# EAGLE design mixer (EAGLE 9.6.2)
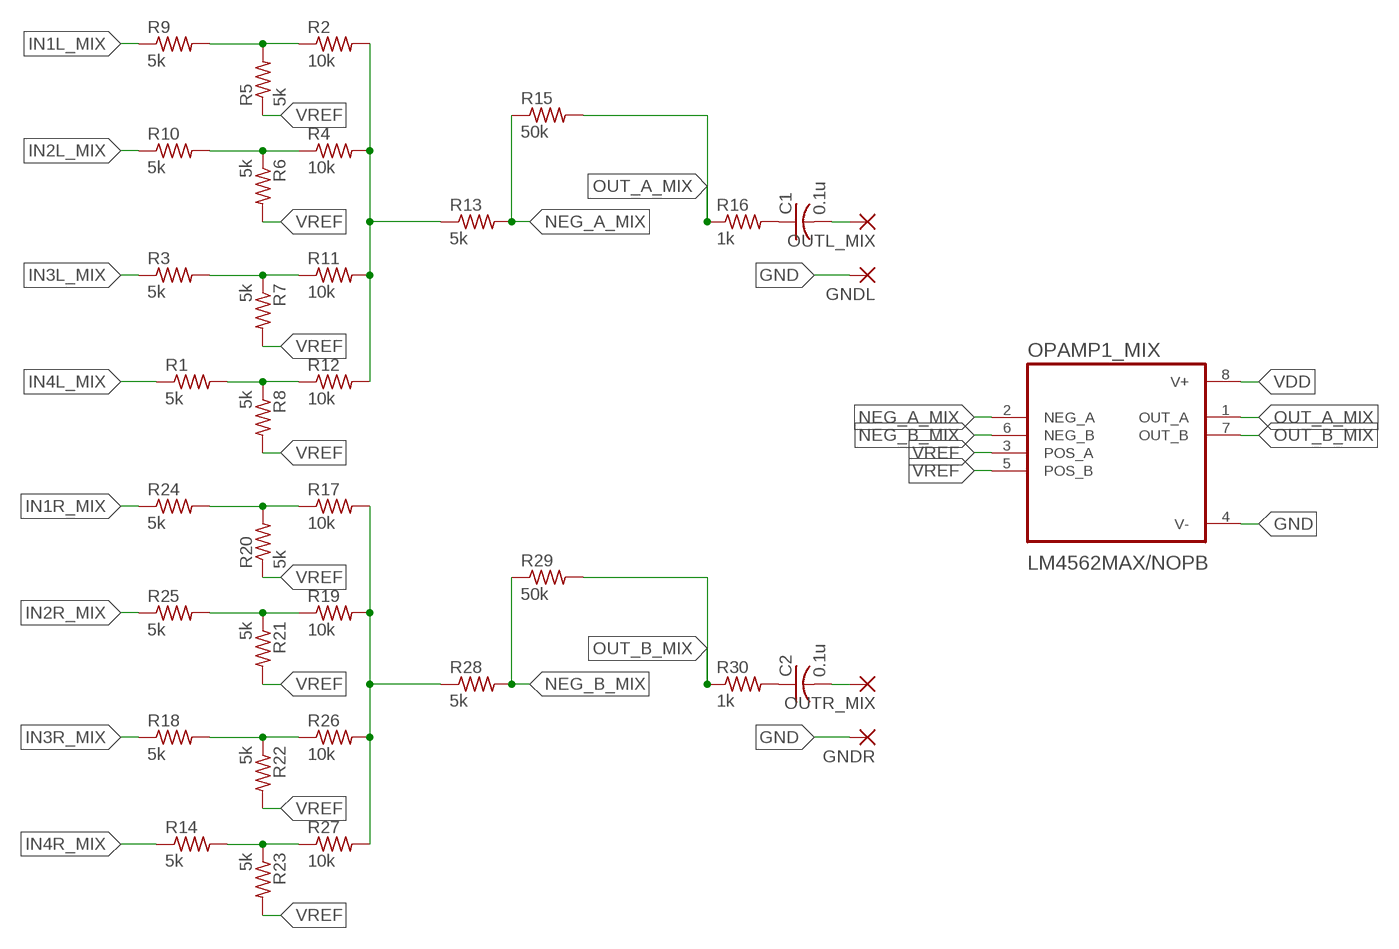
[diagram p0: schematic, sheet 1]

## Parts
C1  0.1u  C-USC0402  [C0402]
C2  0.1u  C-USC0402  [C0402]
GNDL  SMD5  [SMD2,54-5,08]
GNDR  SMD5  [SMD2,54-5,08]
OPAMP1_MIX  LM4562MAX/NOPB  [SOIC127P599X175-8N]
OUTL_MIX  SMD5  [SMD2,54-5,08]
OUTR_MIX  SMD5  [SMD2,54-5,08]
R1  5k  R-US_R0402  [R0402]
R2  10k  R-US_R0402  [R0402]
R3  5k  R-US_R0402  [R0402]
R4  10k  R-US_R0402  [R0402]
R5  5k  R-US_R0402  [R0402]
R6  5k  R-US_R0402  [R0402]
R7  5k  R-US_R0402  [R0402]
R8  5k  R-US_R0402  [R0402]
R9  5k  R-US_R0402  [R0402]
R10  5k  R-US_R0402  [R0402]
R11  10k  R-US_R0402  [R0402]
R12  10k  R-US_R0402  [R0402]
R13  5k  R-US_R0402  [R0402]
R14  5k  R-US_R0402  [R0402]
R15  50k  R-US_R0402  [R0402]
R16  1k  R-US_R0402  [R0402]
R17  10k  R-US_R0402  [R0402]
R18  5k  R-US_R0402  [R0402]
R19  10k  R-US_R0402  [R0402]
R20  5k  R-US_R0402  [R0402]
R21  5k  R-US_R0402  [R0402]
R22  5k  R-US_R0402  [R0402]
R23  5k  R-US_R0402  [R0402]
R24  5k  R-US_R0402  [R0402]
R25  5k  R-US_R0402  [R0402]
R26  10k  R-US_R0402  [R0402]
R27  10k  R-US_R0402  [R0402]
R28  5k  R-US_R0402  [R0402]
R29  50k  R-US_R0402  [R0402]
R30  1k  R-US_R0402  [R0402]

## Nets
GND: GNDL.1(P) GNDR.1(P) OPAMP1_MIX.4(V-)
IN1L_MIX: R9.1
IN1R_MIX: R24.1
IN2L_MIX: R10.1
IN2R_MIX: R25.1
IN3L_MIX: R3.1
IN3R_MIX: R18.1
IN4L_MIX: R1.1
IN4R_MIX: R14.1
N$1: C1.1 R16.2
N$2: C2.1 R30.2
N$3: R17.1 R20.2 R24.2
N$4: R17.2 R19.2 R26.2 R27.2 R28.1
N$5: R14.2 R23.1 R27.1
N$6: R18.2 R22.1 R26.1
N$7: R19.1 R21.1 R25.2
N$13: R2.1 R5.2 R9.2
N$14: R2.2 R4.2 R11.2 R12.2 R13.1
N$15: R1.2 R8.1 R12.1
N$16: R3.2 R7.1 R11.1
N$17: R4.1 R6.1 R10.2
NEG_A_MIX: OPAMP1_MIX.2(NEG_A) R13.2 R15.1
NEG_B_MIX: OPAMP1_MIX.6(NEG_B) R28.2 R29.1
OUT_A_MIX: OPAMP1_MIX.1(OUT_A) R15.2 R16.1
OUT_B_MIX: OPAMP1_MIX.7(OUT_B) R29.2 R30.1
OUTL_MIX: C1.2 OUTL_MIX.1(P)
OUTR_MIX: C2.2 OUTR_MIX.1(P)
VDD: OPAMP1_MIX.8(V+)
VREF: OPAMP1_MIX.3(POS_A) OPAMP1_MIX.5(POS_B) R5.1 R6.2 R7.2 R8.2 R20.1 R21.2 R22.2 R23.2

## Library data of the parts
C1 C2 = rcl:C-US: CAPACITOR, American symbol; SPICEPREFIX: C
GNDL GNDR OUTL_MIX OUTR_MIX = wirepad:SMD5: SMD PAD
OPAMP1_MIX = LM4562MAX_NOPB:LM4562MAX/NOPB: Check availability <https://pricing.snapeda.com/parts/LM4562MAX/NOPB/Texas%20Instruments/view-part?ref=eda>; AVAILABILITY: In Stock; CHECK_PRICES: https://www.snapeda.com/parts/LM4562MAX/NOPB/Texas+Instruments/view-part/?ref=eda; DESCRIPTION: 2-channel, 55-MHz, high-fidelity, high performance audio op amp; MF: Texas Instruments; MP: LM4562MAX/NOPB; PACKAGE: SOIC-8 Texas Instruments; PRICE: None; PURCHASE-URL: https://www.snapeda.com/api/url_track_click_mouser/?unipart_id=21165&manufacturer=Texas Instruments&part_name=LM4562MAX/NOPB&search_term=lm4562; SNAPEDA_LINK: https://www.snapeda.com/parts/LM4562MAX/NOPB/Texas+Instruments/view-part/?ref=snap
R1-R30 = rcl:R-US_: RESISTOR, American symbol; SPICEPREFIX: R

## Board
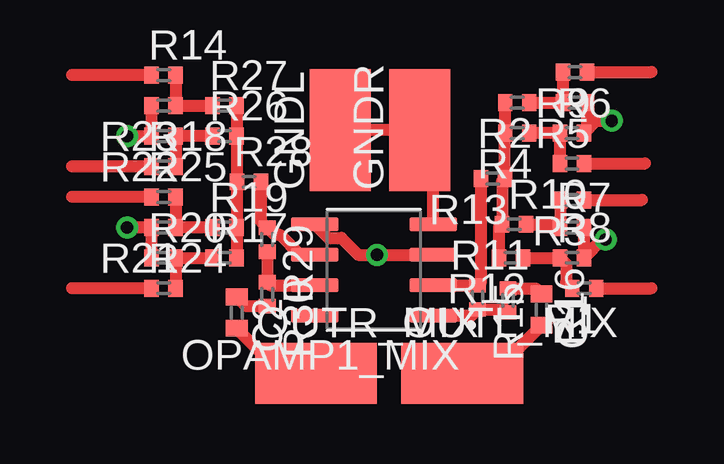
[diagram p1: board, top side]
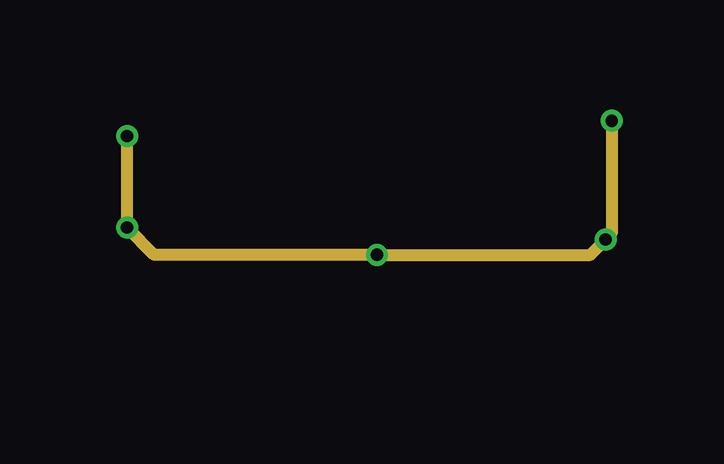
[diagram p2: board, inner layer Route15]

No outline drawn. Coordinates in mm, seen from the top.
Copper layers (1+2*15+16): Top 0.035mm / dielectric 0.2mm / Route2 0.035mm / dielectric 0.15mm / Route15 0.035mm / dielectric 0.2mm / Bottom 0.035mm
Design rules "default *": minimum track width 6mil, minimum drill 0.35mm, track to track 6mil, track to pad 6mil, pad to pad 6mil, via to via 6mil, smd to smd 6mil, copper to edge 40mil, drill to drill 6mil, minimum pad ring 10mil, minimum via ring 8mil, stop-mask expansion 4mil, vias tented up to drill 0mil, thermal gap 10mil

### Footprints (pad centres in the part's own frame; a part is rotated, then mirrored left to right if it is on the bottom)
C0402 = smd 0.7 x 0.9: 1 -0.65,0; 2 0.65,0
SMD2,54-5,08 = smd 2.54 x 5.08: 1 0,0
SOIC127P599X175-8N = smd 1.97 x 0.6: 1 -2.47,1.905; 2 -2.47,0.635; 3 -2.47,-0.635; 4 -2.47,-1.905; 5 2.47,-1.905; 6 2.47,-0.635; 7 2.47,0.635; 8 2.47,1.905
R0402 = smd 0.6 x 0.7: 1 -0.5,0; 2 0.5,0

### Placement (x,y rotation side)
C1  14.48,-9.78 270 top
C2  1.78,-9.91 270 top
GNDL  6.1,-2.29 0 top
GNDR  9.4,-2.29 0 top
OPAMP1_MIX  7.49,-8.13 180 top
OUTL_MIX  11.18,-12.45 270 top
OUTR_MIX  5.08,-12.45 270 top
R1  16.26,-8.89 180 top
R2  13.46,-1.14 180 top
R3  15.75,-5.21 180 top
R4  13.46,-2.41 180 top
R5  15.88,-1.14 180 top
R6  15.75,-2.41 0 top
R7  15.75,-6.35 0 top
R8  15.75,-7.62 0 top
R9  15.88,0.13 180 top
R10  15.75,-3.68 180 top
R11  13.34,-6.22 180 top
R12  13.21,-7.62 180 top
R13  12.45,-4.32 180 top
R14  -1.27,0 0 top
R15  11.81,-9.27 270 top
R16  13.08,-9.4 90 top
R17  1.27,-7.62 0 top
R18  -1.27,-3.81 0 top
R19  1.27,-6.35 0 top
R20  -1.27,-7.62 0 top
R21  -1.27,-6.35 180 top
R22  -1.27,-2.54 180 top
R23  -1.27,-1.27 180 top
R24  -1.27,-8.89 0 top
R25  -1.27,-5.08 0 top
R26  1.27,-2.54 0 top
R27  1.27,-1.27 0 top
R28  2.29,-4.45 0 top
R29  3.05,-6.86 270 top
R30  3.05,-9.14 270 top

### Tracks (layer width: path | path; a pad name or v marks a point on that pad's centre or on a via)
GND
  Top 0.508: OPAMP1_MIX.4 9.96,-2.85 GNDR.1 GNDL.1
IN1L_MIX
  Top 0.508: R9.1 19.05,0.13
IN1R_MIX
  Top 0.508: R24.1 -5.08,-8.89
IN2L_MIX
  Top 0.508: R10.1 18.8,-3.68
IN2R_MIX
  Top 0.508: R25.1 -5.08,-5.08
IN3L_MIX
  Top 0.508: R3.1 18.67,-5.21
IN3R_MIX
  Top 0.508: R18.1 -5.08,-3.81
IN4L_MIX
  Top 0.508: R1.1 19.05,-8.89
IN4R_MIX
  Top 0.508: R14.1 -5.08,0
N$1
  Top 0.508: R16.2 14.25,-8.9 C1.1
N$2
  Top 0.508: R30.2 2.17,-9.64 C2.1
N$3
  Top 0.508: R24.2 R20.2 R17.1
N$4
  Top 0.508: R27.2 R26.2 1.77,-4.43 R28.1 1.79,-6.33 R19.2 R17.2
N$5
  Top 0.508: R14.2 R23.1 R27.1
N$6
  Top 0.508: R18.2 R22.1 R26.1
N$7
  Top 0.508: R25.2 R21.1 R19.1
N$13
  Top 0.508: R9.2 R5.2 R2.1
N$14
  Top 0.508: R12.2 12.71,-6.35 R11.2 12.84,-4.43 R13.1 12.95,-2.43 R4.2 R2.2
N$15
  Top 0.508: R12.1 R8.1 15.5,-7.87 15.5,-8.64 R1.2
N$16
  Top 0.508: R3.2 R7.1 15.12,-6.22 R11.1
N$17
  Top 0.508: R10.2 R6.1 R4.1
NEG_A_MIX
  Top 0.508: R13.2 11.95,-8.64 R15.1 | R15.1 | OPAMP1_MIX.2 R15.1
NEG_B_MIX
  Top 0.508: R28.2 2.79,-6.1 R29.1 3.34,-6.65 3.57,-6.65 4.41,-7.49 OPAMP1_MIX.6
OUT_A_MIX
  Top 0.508: OPAMP1_MIX.1 11.55,-10.03 R15.2 12.95,-9.77 R16.1
OUT_B_MIX
  Top 0.508: R29.2 R30.1 3.17,-8.76 OPAMP1_MIX.7
OUTL_MIX
  Top 0.508: C1.2 12.46,-12.45 OUTL_MIX.1
OUTR_MIX
  Top 0.508: C2.2 3.67,-12.45 OUTR_MIX.1
VREF  (via drill 0.51)
  Top 0.508: R7.2 R8.2 17.01,-6.86 v17.14,-6.86 | R5.1 16.38,-2.29 R6.2 16.76,-1.91 v17.4,-1.91 | R20.1 R21.2 v-2.79,-6.35 | R23.2 R22.2 v-2.79,-2.54 | OPAMP1_MIX.5 5.59,-6.79 6.13,-6.79 6.84,-7.49 v7.62,-7.49 OPAMP1_MIX.3
  Route15 0.508: v17.4,-1.91 17.4,-6.6 v17.14,-6.86 16.51,-7.49 v7.62,-7.49 -1.65,-7.49 v-2.79,-6.35 v-2.79,-2.54